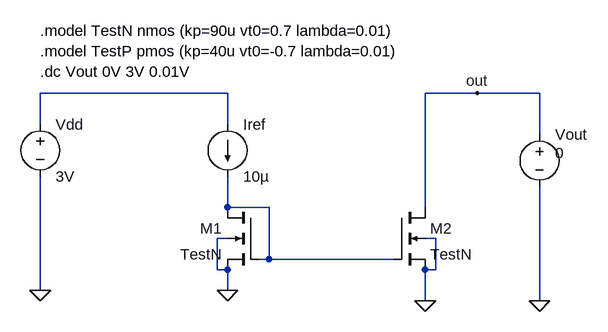
[diagram p0: schematic simple.asc]
simple.asc, the LTspice schematic file:
Version 4
SHEET 1 880 1236
WIRE -400 896 -688 896
WIRE -16 896 -96 896
WIRE 80 896 -16 896
WIRE -688 944 -688 896
WIRE -400 944 -400 896
WIRE 80 960 80 896
WIRE -400 1072 -400 1024
WIRE -336 1072 -400 1072
WIRE -96 1072 -96 896
WIRE -400 1120 -416 1120
WIRE -80 1120 -96 1120
WIRE -336 1152 -336 1072
WIRE -336 1152 -352 1152
WIRE -144 1152 -336 1152
WIRE -416 1168 -416 1120
WIRE -400 1168 -416 1168
WIRE -80 1168 -80 1120
WIRE -80 1168 -96 1168
WIRE -688 1200 -688 1024
WIRE -400 1200 -400 1168
WIRE -96 1216 -96 1168
WIRE 80 1216 80 1040
FLAG -400 1200 0
FLAG -688 1200 0
FLAG -96 1216 0
FLAG 80 1216 0
FLAG -16 896 out
SYMBOL voltage 80 944 R0
WINDOW 3 24 44 Left 2
WINDOW 123 0 0 Left 2
WINDOW 39 0 0 Left 2
SYMATTR Value 0
SYMATTR InstName Vout
SYMBOL current -400 944 R0
WINDOW 123 0 0 Left 2
WINDOW 39 0 0 Left 2
SYMATTR InstName Iref
SYMATTR Value 10µ
SYMBOL voltage -688 928 R0
SYMATTR InstName Vdd
SYMATTR Value 3V
SYMBOL nmos4 -352 1072 M0
SYMATTR InstName M1
SYMATTR Value TestN
SYMATTR Value2 l=10u w=10u
SYMBOL nmos4 -144 1072 R0
SYMATTR InstName M2
SYMATTR Value TestN
SYMATTR Value2 l=10u w=100u
TEXT -688 800 Left 2 !.model TestN nmos (kp=90u vt0=0.7 lambda=0.01)\n.model TestP pmos (kp=40u vt0=-0.7 lambda=0.01)\n.dc Vout 0V 3V 0.01V

The netlist it stands for:
* simple.asc
Vout out 0 0
Iref N001 N002 10µ
Vdd N001 0 3V
M1 N002 N002 0 0 TestN l=10u w=10u
M2 out N002 0 0 TestN l=10u w=100u
.model NMOS NMOS
.model PMOS PMOS
.lib standard.mos
.model TestN nmos (kp=90u vt0=0.7 lambda=0.01)
.model TestP pmos (kp=40u vt0=-0.7 lambda=0.01)
.dc Vout 0V 3V 0.01V
.backanno
.end